# EAGLE design anemometer-r2 (EAGLE 9.2.2)
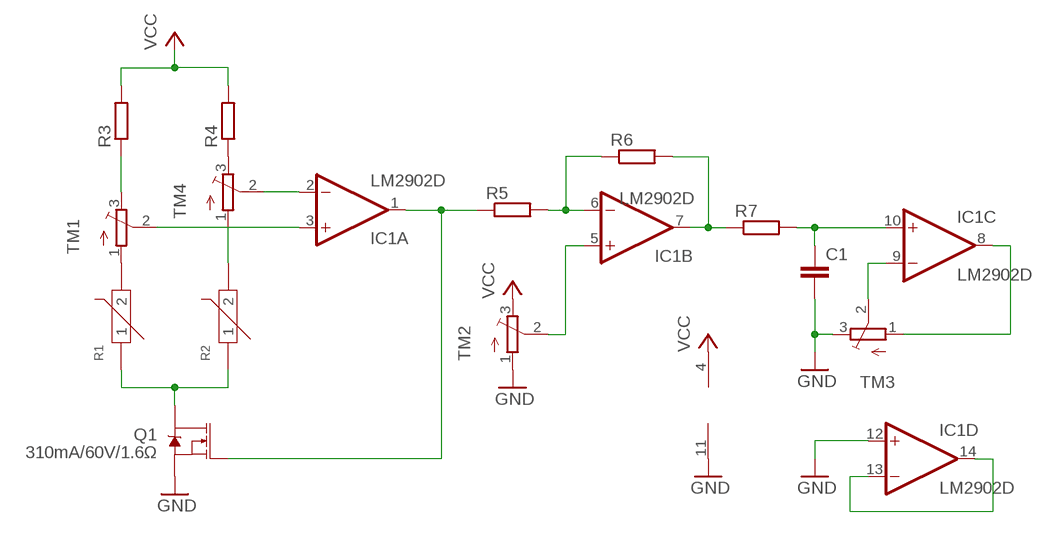
[diagram p0: schematic, sheet 1]

## Parts
C1  C-EUC0603  [C0603]
IC1  LM2902D  [SO14]
Q1  310mA/60V/1.6Ω  MOSFET-NCH-2N7002PW  [SOT323]
R1  NCP18WF104F03RC  THERMISTOR-RES-NTC-100K(0603)  [R0603]
R2  NCP18WF104F03RC  THERMISTOR-RES-NTC-100K(0603)  [R0603]
R3  R-EU_R0603  [R0603]
R4  R-EU_R0603  [R0603]
R5  R-EU_R0603  [R0603]
R6  R-EU_R0603  [R0603]
R7  R-EU_R0603  [R0603]
TM1  TRIMPOTTC33X  [TC33X]
TM2  TRIMPOTTC33X  [TC33X]
TM3  TRIMPOTTC33X  [TC33X]
TM4  TRIMPOTTC33X  [TC33X]

## Nets
GND: C1.2 IC1.11(P:V-) IC1.12(D:+IN) Q1.2(S) TM2.1(A) TM3.3(E)
N$1: Q1.3(D) R1.1 R2.1
N$2: R1.2 TM1.1(A)
N$3: R2.2 TM4.1(A)
N$4: IC1.3(A:+IN) TM1.2(S)
N$5: IC1.2(A:-IN) TM4.2(S)
N$6: R4.1 TM4.3(E)
N$7: R3.1 TM1.3(E)
N$8: IC1.6(B:-IN) R5.2 R6.1
N$9: IC1.5(B:+IN) TM2.2(S)
N$10: IC1.1(A:OUT) Q1.1(G) R5.1
N$11: IC1.7(B:OUT) R6.2 R7.1
N$12: C1.1 IC1.10(C:+IN) R7.2
N$13: IC1.9(C:-IN) TM3.2(S)
N$14: IC1.8(C:OUT) TM3.1(A)
N$15: IC1.13(D:-IN) IC1.14(D:OUT)
VCC: IC1.4(P:V+) R3.2 R4.2 TM2.3(E)

## Library data of the parts
C1 = resistor:C-EU: CAPACITOR, European symbol
IC1 = linear:LM2902: Low power quad operational amplifier Source: Data sgeet <http://www.st.com/internet/com/TECHNICAL_RESOURCES/TECHNICAL_LITERATURE/DATASHEET/CD00000533.pdf>; SPICEPREFIX: J
Q1 = SparkFun-DiscreteSemi:MOSFET-NCH: N-channel MOSFETs Voltage controlled devices that allow control of high current outputs. SparkFun Products: SparkFun OpenScale <https://www.sparkfun.com/products/13261> SparkFun Digital Sandbox <https://www.sparkfun.com/products/12651> SparkFun Monster Moto Shield <https://www.sparkfun.com/products/10182> SparkFun MOSFET Power Controller <https://www.sparkfun.com/products/11214>; PROD_ID: TRANS-11151
R1 R2 = Seeed-Resistor:THERMISTOR-RES-NTC-100K(0603): 314110001; MPN: NCP18WF104F03RC
R3-R7 = resistor:R-EU_: RESISTOR, European symbol
TM1-TM4 = adafruit:TRIMPOT: SMT trimmer potentiometer part number TC33X http://www.ladyada.net/library/eagle

## Board
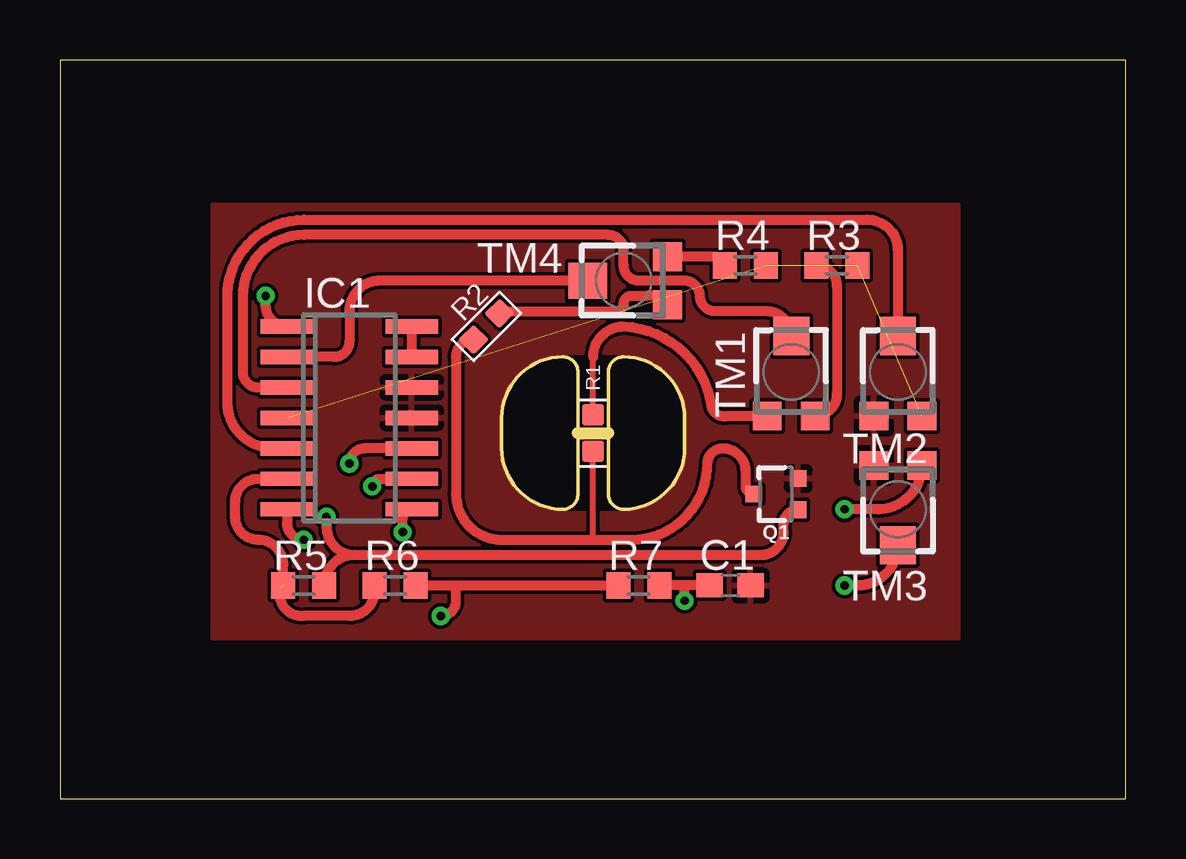
[diagram p1: board, top side]
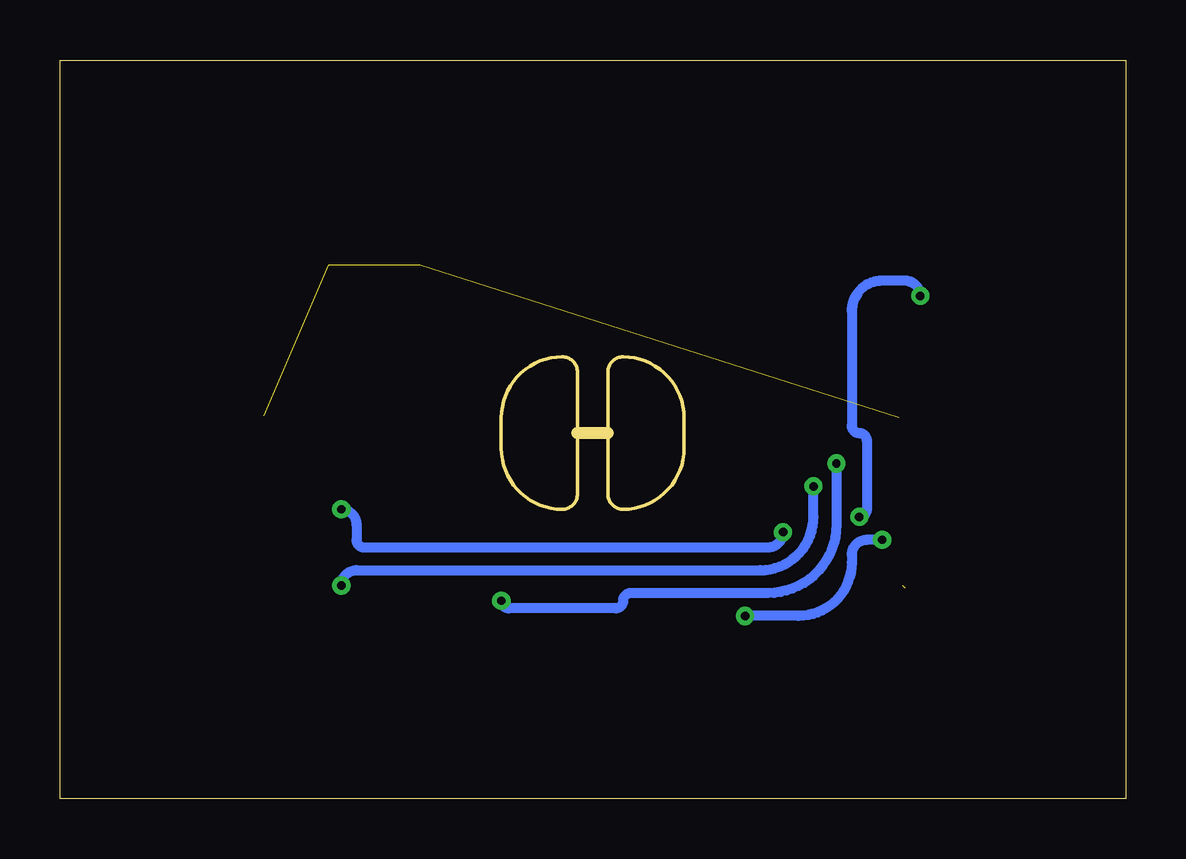
[diagram p2: board, bottom side, seen from below]

Size 44.43 x 30.78 mm. Coordinates in mm from the lower left corner, seen from the top.
Outline: 0,0 44.43,0 44.43,30.78 0,30.78 0,0
Copper layers (1*16): Top 0.035mm / dielectric 1.5mm / Bottom 0.035mm
Design rules "default": minimum track width 6mil, minimum drill 0.35mm, track to track 6mil, track to pad 6mil, pad to pad 6mil, via to via 6mil, smd to smd 6mil, copper to edge 40mil, drill to drill 6mil, minimum pad ring 10mil, minimum via ring 8mil, stop-mask expansion 4mil, vias tented up to drill 0mil, thermal gap 10mil
Milling: 15 lines

### Footprints (pad centres in the part's own frame; a part is rotated, then mirrored left to right if it is on the bottom)
C0603 = smd 1.1 x 1: 1 -0.85,0; 2 0.85,0
SO14 = smd 0.6 x 2.2: 1 -3.81,-2.6; 2 -2.54,-2.6; 3 -1.27,-2.6; 4 0,-2.6; 5 1.27,-2.6; 6 2.54,-2.6; 7 3.81,-2.6; 8 3.81,2.6; 9 2.54,2.6; 10 1.27,2.6; 11 0,2.6; 12 -1.27,2.6; 13 -2.54,2.6; 14 -3.81,2.6
SOT323 = smd 0.7 x 0.7: 1 -0.65,-0.925; 2 0.65,-0.925; 3 0,0.925
R0603 = smd 0.889 x 0.889: 1 0,0.762; 2 0,-0.762
R0603' = smd 1 x 1.1: 1 -0.85,0; 2 0.85,0
TC33X = smd 1.2 x 1.2: 1 -1,-1.825; 3 1,-1.825 | smd 1.5 x 1.6: 2 0,1.5

### Placement (x,y rotation side)
C1  27.94,8.89 0 top
IC1  12.06,15.88 270 top
Q1  29.84,12.7 90 top
R1  22.23,15.24 180 top
R2  17.78,19.69 135 top
R3  [R0603']  32.38,22.23 0 top
R4  [R0603']  28.57,22.23 0 top
R5  [R0603']  10.16,8.89 180 top
R6  [R0603']  13.97,8.89 0 top
R7  [R0603']  24.13,8.89 0 top
TM1  30.48,17.78 0 top
TM2  34.93,17.78 0 top
TM3  34.93,12.06 180 top
TM4  23.49,21.59 90 top

### Tracks (layer width: path | path; a pad name or v marks a point on that pad's centre or on a via)
GND
  pour Top: 6.35,24.77 37.46,24.77 37.46,6.67 6.35,6.67
  cutout Top: 22.23,18.41 20.95,18.41 arc90 18.41,15.88 18.41,14.61 arc90 20.95,12.06 23.49,12.06 arc90 26.03,14.61 26.03,15.88 arc90 23.49,18.41
N$1
  Top 0.254: 22.23,10.79 R1.1
  Top 0.406: R2.1 arc90 16.51,18.41 16.51,12.7 arc90 18.41,10.79 22.23,10.79 23.81,10.79 arc90 26.99,13.97 arc-90 27.62,14.61 arc-90 28.57,13.65 28.57,13.04 arc90 Q1.3
N$2
  Top 0.254: R1.2 22.23,18.41
  Top 0.406: 22.23,18.41 arc-90 23.49,19.69 arc-80 27.15,16.35 arc90 27.86,15.95 TM1.1
N$3
  Top 0.406: 25.13,20.59 TM4.1 arc-90 24.95,20.95 24.43,20.95 | 24.43,20.95 arc37 24.43,20.95 | R2.2 arc-90 18.41,20.32 23.18,20.32 arc90 23.49,20.64 arc-90 23.81,20.95 24.43,20.95
N$4
  Top 0.406: TM1.2 arc90 29.44,20.32 27.3,20.32 arc-90 26.67,20.95 arc90 26.03,21.59 24.13,21.59 arc-90 23.49,22.23 23.49,22.86 arc90 22.86,23.49 10.16,23.49 arc90 7.62,20.95 7.62,17.78 arc90 8.26,17.14 IC1.3
N$5
  Top 0.406: TM4.2 13.34,21.59 arc90 12.06,20.32 12.06,19.05 arc-90 11.43,18.41 IC1.2
N$6
  Top 0.406: R4.1 27.36,22.59 TM4.3
N$7
  Top 0.406: R3.1 arc-90 32.38,21.38 32.38,16.86 arc-90 TM1.3
N$8  (1 unrouted)
  Top 0.406: R6.1 13.12,8.68 arc-90 12.06,7.62 10.16,7.62 arc-112 9.2,8.79 | IC1.6 arc19 8.26,13.34 arc90 7.3,12.38 7.3,11.75 arc90 8.26,10.79 arc-90 9.31,9.74 R5.2
N$9
  Top 0.406: IC1.5 8.89,14.61 arc-90 6.98,16.51 6.98,20.95 arc-90 10.16,24.13 33.66,24.13 arc-90 34.93,22.86 TM2.2
N$10  (via drill 0.35)
  Top 0.406: 12.28,10.16 arc90 R5.1 | IC1.1 arc-90 8.57,20.58 v8.57,20.95 | v11.11,11.75 11.11,11.33 arc90 12.28,10.16 | Q1.1 arc90 30.16,11.44 30.16,11.11 arc-90 29.21,10.16 12.28,10.16
  Bottom 0.406: v8.57,20.95 arc-90 9.21,21.59 10.16,21.59 arc-90 11.43,20.32 11.43,15.56 arc-90 11.11,15.24 arc90 10.8,14.92 10.8,12.06 arc90 v11.11,11.75
N$11  (via drill 0.35)
  Top 0.406: R6.2 16.51,8.89 | 16.51,8.89 R7.1 | IC1.7 9.46,11.49 arc90 v10.16,10.79 | v15.88,7.62 arc90 16.51,8.25 16.51,8.89
  Bottom 0.406: v10.16,10.79 10.8,10.79 arc-90 11.43,10.16 11.43,9.84 arc90 13.65,7.62 v15.88,7.62
N$12  (via drill 0.35)
  Top 0.406: C1.1 26.03,8.89 | 26.03,8.89 R7.2 | IC1.10 12.7,14.61 arc90 v12.06,13.97 | v26.03,8.25 26.03,8.89
  Bottom 0.406: v12.06,13.97 12.06,11.43 arc90 14.92,8.57 20.64,8.57 arc-90 20.95,8.25 arc90 21.27,7.94 25.72,7.94 arc90 v26.03,8.25
N$13  (via drill 0.35)
  Top 0.406: TM3.2 arc-90 33.25,8.89 v32.7,8.89 | v13.02,13.02 arc-90 13.34,13.34 IC1.9
  Bottom 0.406: v32.7,8.89 arc90 32.07,9.52 15.24,9.52 arc-90 13.02,11.75 v13.02,13.02
N$14  (via drill 0.35)
  Top 0.406: TM3.1 arc-90 34.1,12.06 v32.7,12.06 | v14.29,11.11 14.29,11.69 arc-90 IC1.8
  Bottom 0.406: v32.7,12.06 arc90 32.07,11.43 32.07,10.79 arc-90 31.75,10.48 14.92,10.48 arc-90 v14.29,11.11
N$15
  Top 0.406: IC1.14 IC1.13
VCC  (3 unrouted)